# Altium project AS800-TempCB.PrjPcb
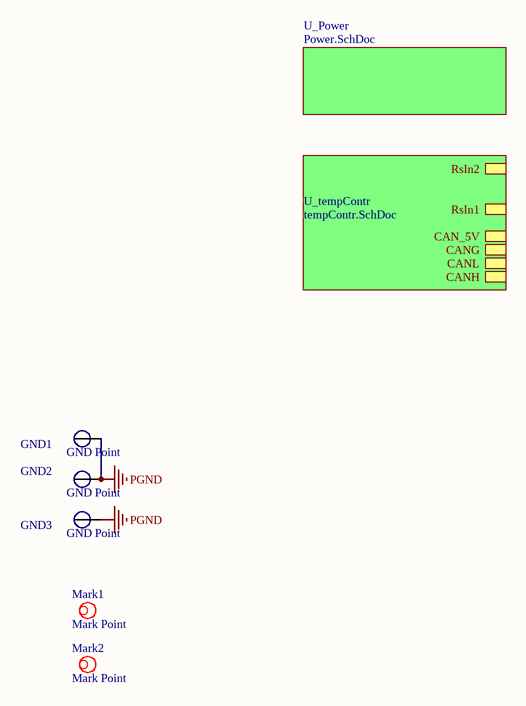
[diagram p0: MB_TOP.SchDoc]
3 sheets, 246 parts. Net scope: hierarchical (ports join the sheet entries above them; power ports are global).
Board file: AS800-Temp V1.1.PcbDoc
Sheets:
  MB_TOP.SchDoc
    U_Power = Power.SchDoc
    U_tempContr = tempContr.SchDoc

## Sheet MB_TOP.SchDoc
size A4; PageSetup: Record=PageOptions|CenterHorizontal=True|CenterVertical=True|PrintScale=0.36|XCorrection=1.00|YCorrection=1.00|PrintKind=0|BorderSize=5000000|LeftOffset=0|BottomOffset=0|Orientation=2|PaperLength=1000|PaperWidth=1000|Scale=100|PaperSource=7|PrintQuality=-4|MediaType=1|DitherType=10|PaperKind=A4|PrintScaleMode=1

### Parts
GND1  GND Point  [Gnd_Point]
GND2  GND Point  [Gnd_Point]
GND3  GND Point  [Gnd_Point]
Mark1  Mark Point  [MARK 3mm]
Mark2  Mark Point  [MARK 3mm]

### Sub-sheets
U_Power = Power.SchDoc: no entries
U_tempContr = tempContr.SchDoc: CANH, CANL, CANG, CAN_5V, RsIn1, RsIn2

### Nets
PGND: GND1.1(GND) GND2.1(GND) GND3.1(GND)

### Library data of the parts
GND1-GND3 = GND_Point
Mark1 Mark2 = MARK

## Sheet Power.SchDoc
size C
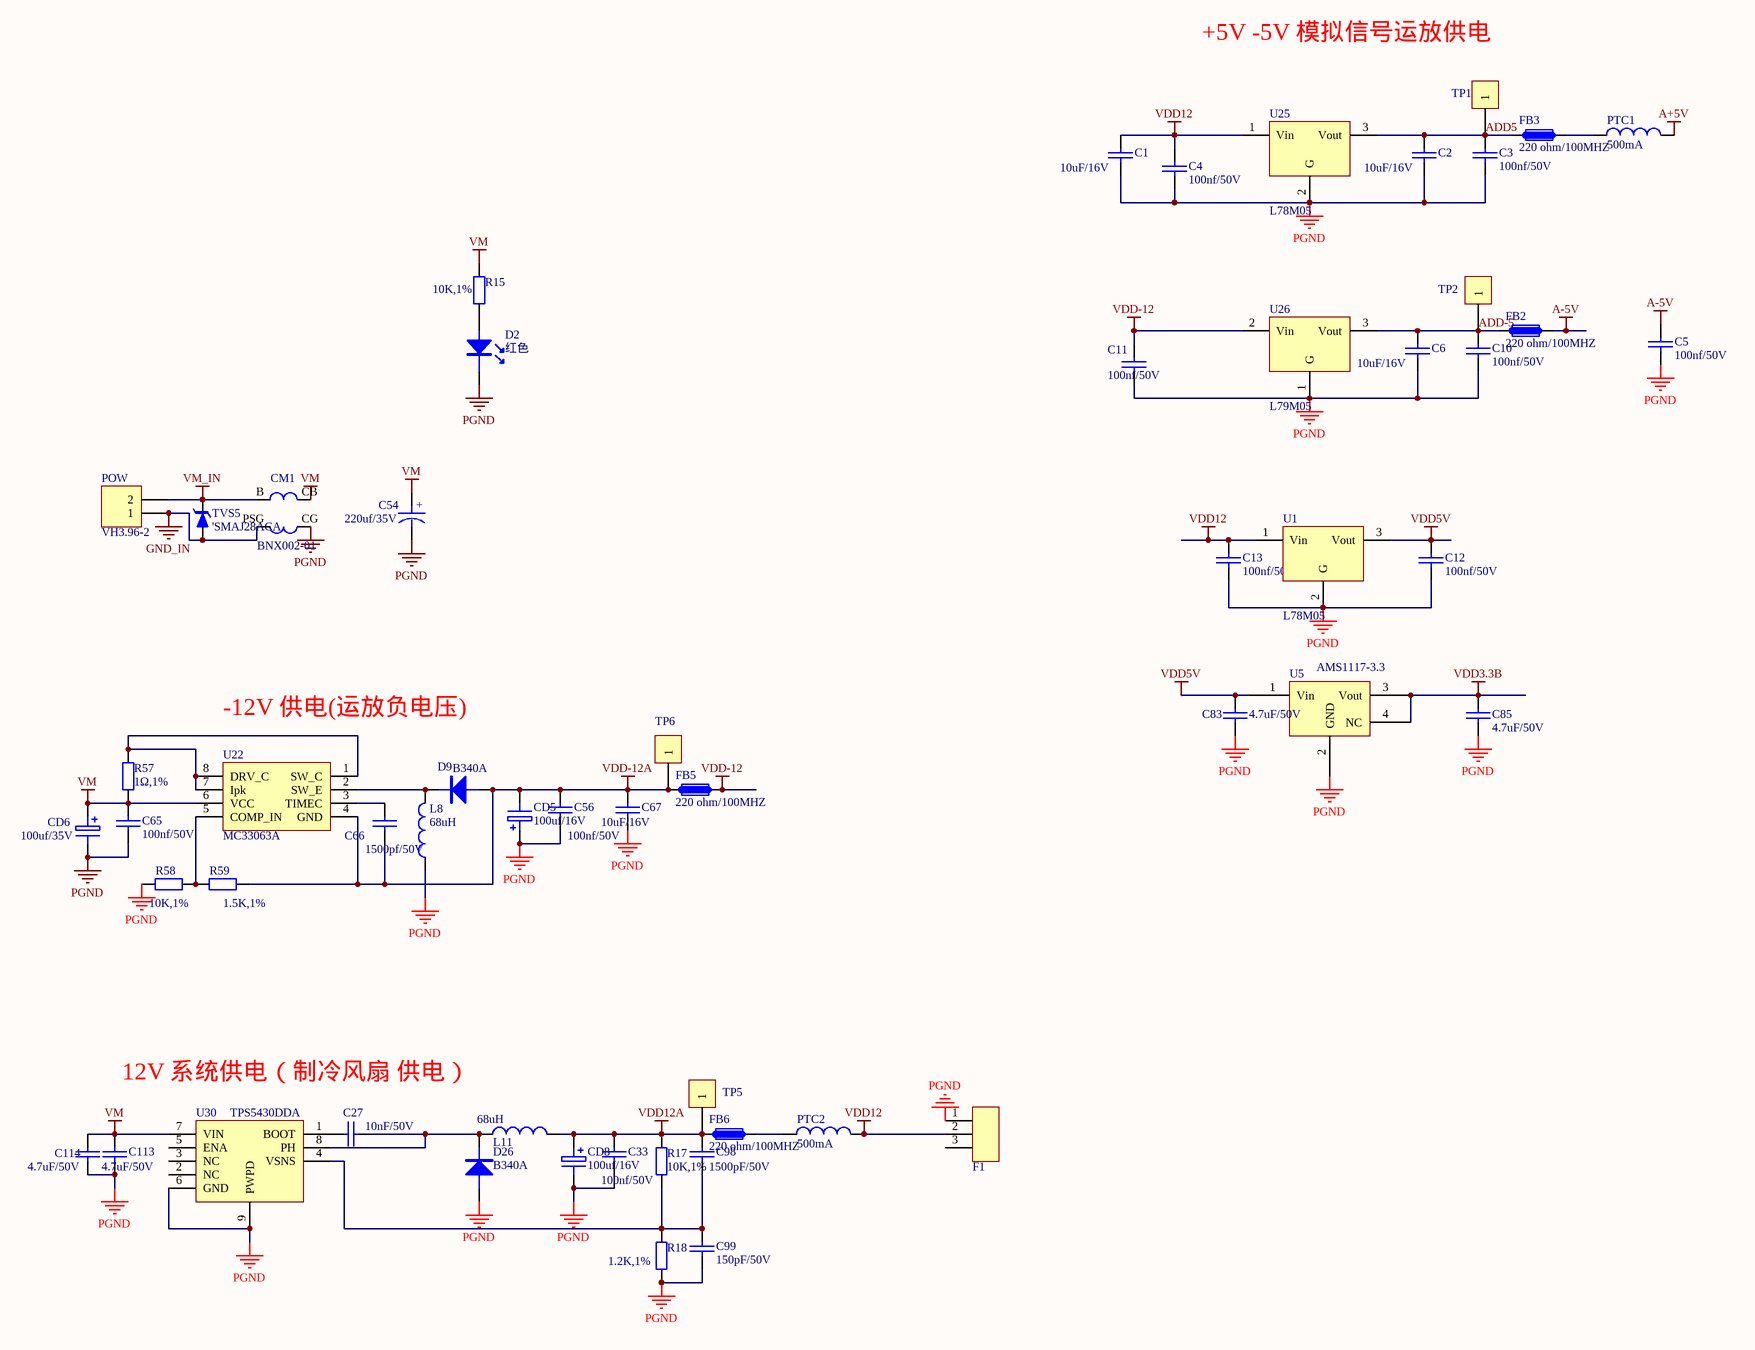
[diagram p1: Power.SchDoc]

### Parts
C1  10uF/16V  [1206]
C2  10uF/16V  [1206]
C3  100nf/50V  [0805]
C4  100nf/50V  [0805]
C5  100nf/50V  [0805]
C6  10uF/16V  [1206]
C10  100nf/50V  [0805]
C11  100nf/50V  [0805]
C12  100nf/50V  [0805]
C13  100nf/50V  [0805]
C27  10nF/50V  [0805]
C33  100nf/50V  [0805]
C54  220uf/35V  [CX8*10.5]
C56  100nf/50V  [0805]
C65  100nf/50V  [0805]
C66  1500pf/50V  [0805]
C67  10uF/16V  [1206]
C83  4.7uF/50V  [1206]
C85  4.7uF/50V  [1206]
C98  1500pF/50V  [0805]
C99  150pF/50V  [0805]
C113  4.7uF/50V  [1206]
C114  4.7uF/50V  [1206]
CD5  100uf/16V  [7343D]
CD6  100uf/35V  [CX6.3*5.4]
CD8  100uf/16V  [7343D]
CM1  BNX002-01  [BNX-002-01]
D2  value 红色  [LED_0805]  (hidden comment: LED,Red)
D9  B340A  [SMA]
D26  B340A  [SMA]
F1  KF2510-3P  [KF2510-3]  (value not drawn)
FB2  220 ohm/100MHZ  [0805]
FB3  220 ohm/100MHZ  [0805]
FB5  220 ohm/100MHZ  [0805]
FB6  220 ohm/100MHZ  [0805]
L8  68uH  [INDUCTOR 6*6]
L11  68uH  [INDUCTOR 6*6]
POW  VH3.96-2  [VH3.96-2]
PTC1  value 500mA  [1210]  (hidden comment: PTCC)
PTC2  value 500mA  [1210]  (hidden comment: PTCC)
R15  10K,1%  [0805]
R17  10K,1%  [0805]
R18  1.2K,1%  [0805]
R57  1Ω,1%  [2512]
R58  10K,1%  [0805]
R59  1.5K,1%  [0805]
TP1  TP  [TP1]  (value not drawn)
TP2  TP  [TP1]  (value not drawn)
TP5  TP  [TP1]  (value not drawn)
TP6  TP  [TP1]  (value not drawn)
TVS5  'SMAJ28ACA  [SMB]
U1  L78M05  [TO-252]
U5  AMS1117-3.3  [SOT223S]
U22  MC33063A  [SOIC8]
U25  L78M05  [TO-252]
U26  L79M05  [TO-252]
U30  TPS5430DDA  [S0IC8-DDA]

### Nets
A+5V: PTC1.2
A-5V: C5.1 FB2.2
GND_IN: CM1.PSG POW.1 TVS5.A
PGND: C1.2 C2.2 C3.2 C4.2 C5.2 C6.2 C10.2 C11.2 C12.2 C13.2 C33.2 C54.2 C56.2 C65.2 C67.2 C83.2 C85.2 C99.1 C113.2 C114.2 CD5.1 CD6.2 CD8.2 CM1.CG D2.K D26.A F1.1 L8.1 R18.1 R58.2 U1.2(G) U5.2(GND) U25.2(G) U26.1(G) U30.6(GND) U30.9(PWPD)
VDD3.3B: C85.1 U5.3(Vout) U5.4(NC)
VDD5V: C12.1 C83.1 U1.3(Vout) U5.1(Vin)
VDD12: C1.1 C4.1 C13.1 F1.2 PTC2.2 U1.1(Vin) U25.1(Vin)
VDD12A: C33.1 C98.2 CD8.1 FB6.1 L11.2 R17.2 TP5.1
VDD-12: C11.1 FB5.2 U26.2(Vin)
VDD-12A: C56.1 C66.2 C67.1 CD5.2 D9.A FB5.1 R59.1 TP6.1 U22.4(GND)
VM: C54.1 C65.1 C113.1 C114.1 CD6.1 CM1.CB R15.1 R57.2 U22.6(VCC) U30.7(VIN)
VM_IN: CM1.B POW.2 TVS5.K
ADD5: C2.1 C3.1 FB3.1 TP1.1 U25.3(Vout)
ADD-5: C6.1 C10.1 FB2.1 TP2.1 U26.3(Vout)
NetC27_1: C27.1 U30.1(BOOT)
NetC27_2: C27.2 D26.K L11.1 U30.8(PH)
NetC66_1: C66.1 U22.3(TIMEC)
NetC98_1: C98.1 C99.2 R17.1 R18.2 U30.4(VSNS)
NetD2_A: D2.A R15.2
NetD9_K: D9.K L8.2 U22.2(SW_E)
NetFB3_2: FB3.2 PTC1.1
NetFB6_2: FB6.2 PTC2.1
NetR57_1: R57.1 U22.1(SW_C) U22.7(Ipk) U22.8(DRV_C)
NetR58_1: R58.1 R59.2 U22.5(COMP_IN)

Not connected (* = marked no-connect by the designer): F1 3; U30 2(NC) 3(NC) 5(ENA)

### Notes on the sheet
- +5V -5V 模拟信号运放供电
- -12V 供电(运放负电压)
- 12V 系统供电（制冷风扇 供电）
- (in symbol CAPACITOR POL) +

### Library data of the parts
C1-C6 C10-C13 C27 C33 C56 C65-C67 C83 C85 C98 C99 C113 C114 = CAP: Capacitor
  C1 C2 C6: Value: 10uF/16V
  C27: Value: 10nF/50V
  C33 C56 C65: Value: 100nf/50V
  C66: Value: 1500pf/50V
  C83 C85 C113 C114: Value: 4.7uF/50V
  C98: Value: 1500pF/50V
  C99: Value: 150pF/50V
C54 = CAPACITOR POL: Capacitor
CD5 CD6 CD8 = Capacitor Electrolytic: Electrolytic Capacitor
CM1 = EMIFIL-BNX: inductor
D2 = LED
D9 D26 = DIODE
F1 = KF2510-3P: KF2510-2.54-3P 针座
FB2 FB3 FB5 FB6 = Ferrite Bead
L8 L11 = INDUCTOR
POW = VH-2: VH3.96 2P 插座; Revision: 17-Jul-2002: Re-released for DXP Platform.; Publisher: Altium Limited
R15 R17 R18 R57-R59 = Res2: Resistor; Published: 8-Jun-2000; Revision: July-2002: Re-released for DXP Platform.; Publisher: Altium Limited
TP1 TP2 TP5 TP6 = TP: Connector
TVS5 = TVS
U1 U25 = L78XX: L78XX系列芯片
U5 = LM1117-33
U26 = L79XX: L79XX系列芯片

## Sheet tempContr.SchDoc
size D; Author: 七星; Engineer: 七星; Revision: V1.0
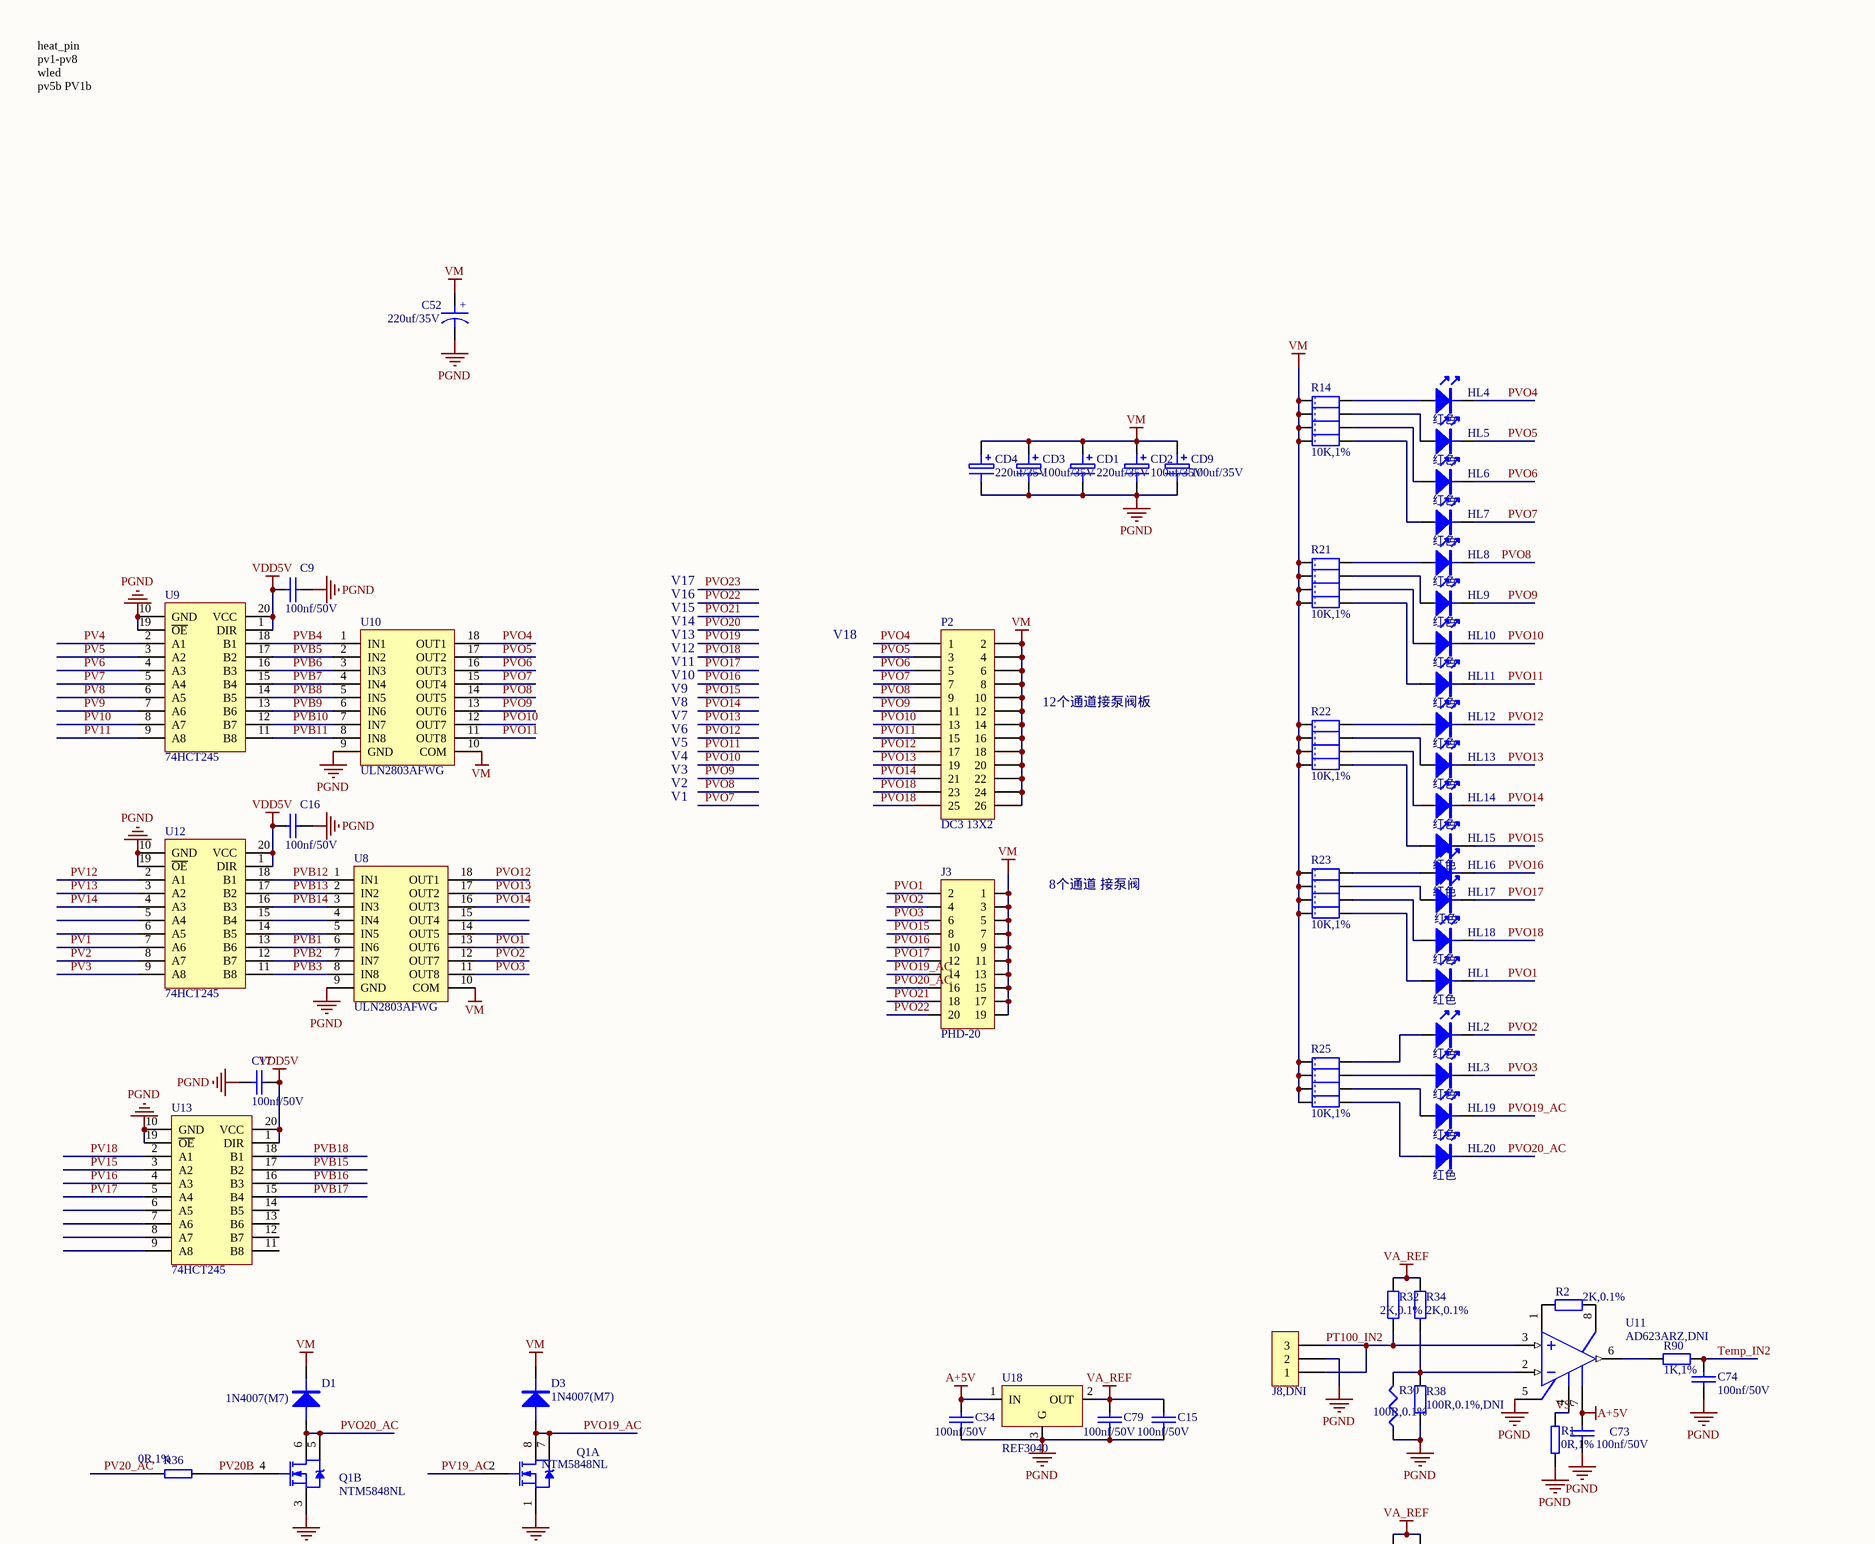
[diagram p2: tempContr.SchDoc, top left]
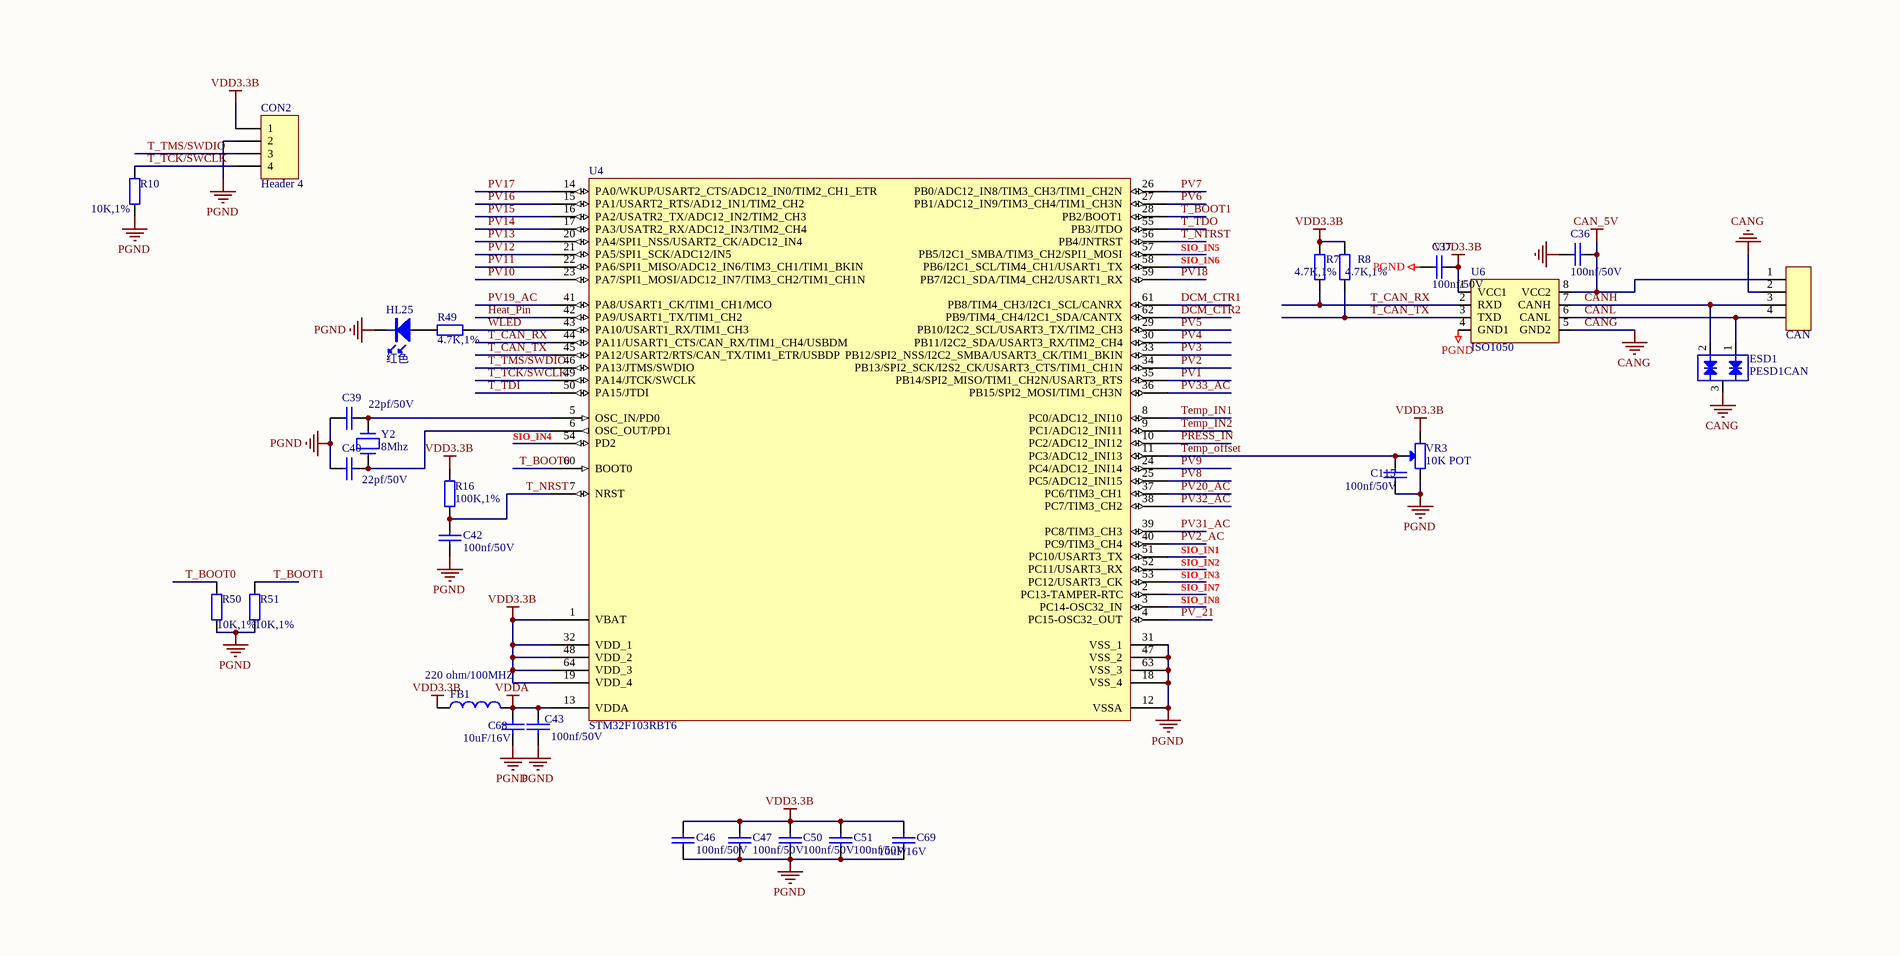
[diagram p3: tempContr.SchDoc, top right]
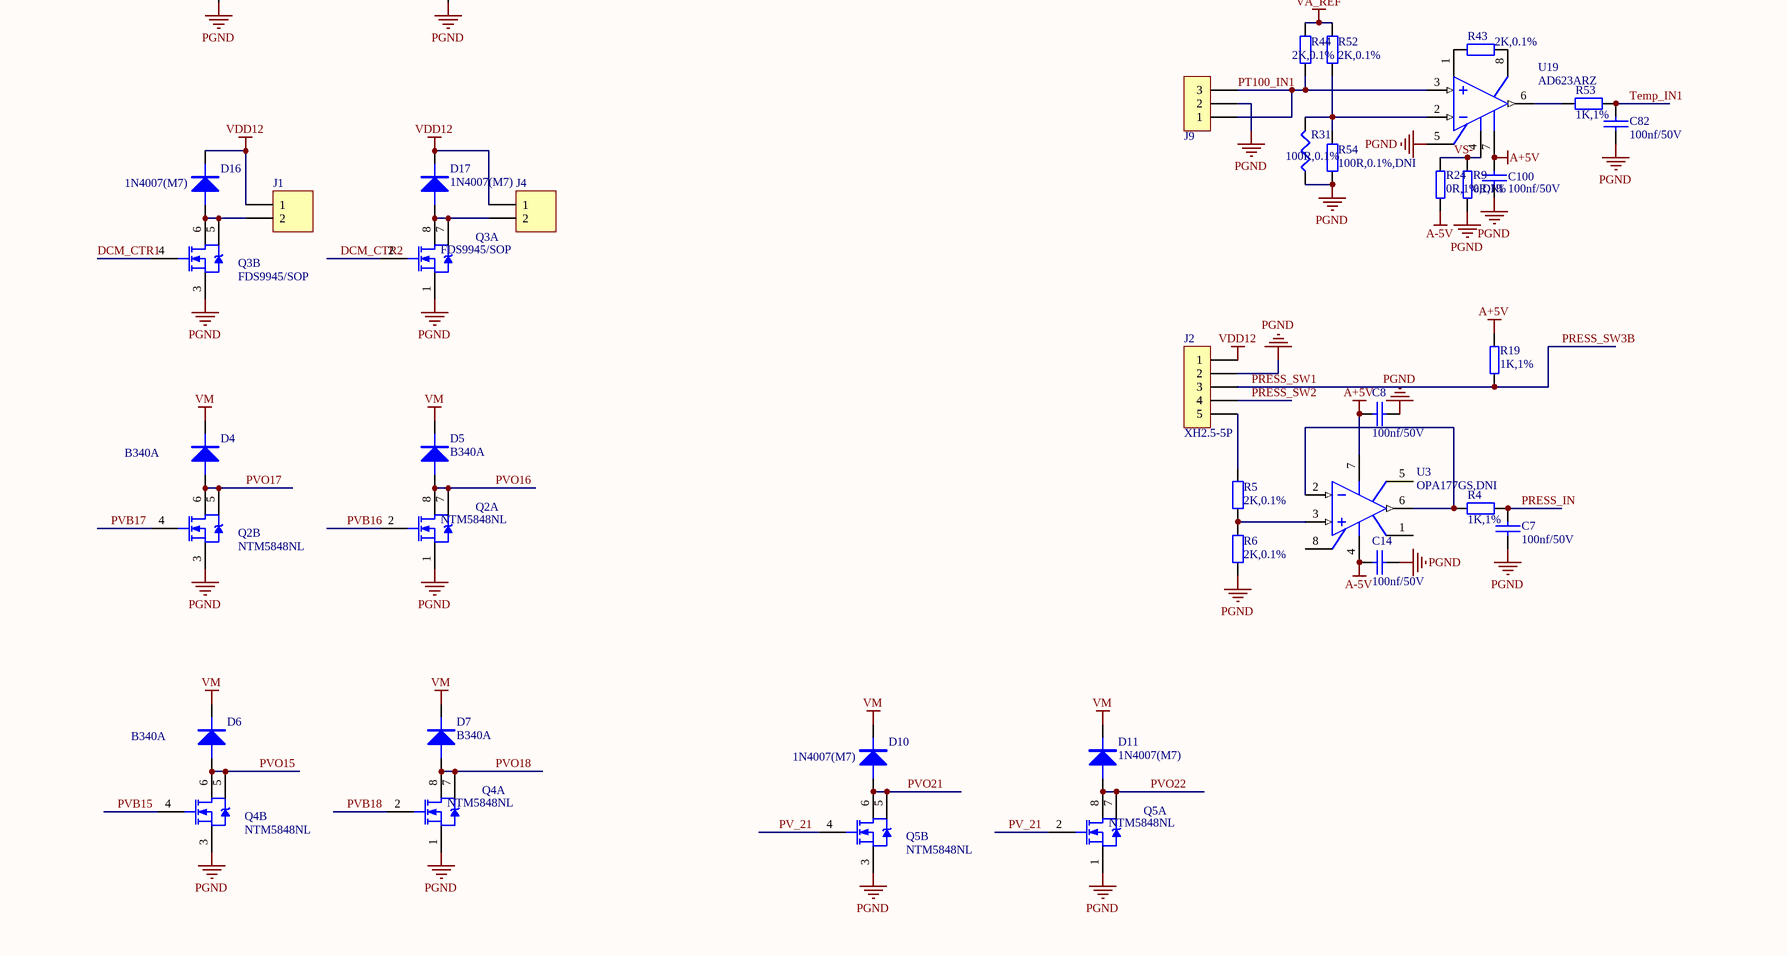
[diagram p4: tempContr.SchDoc, bottom left]
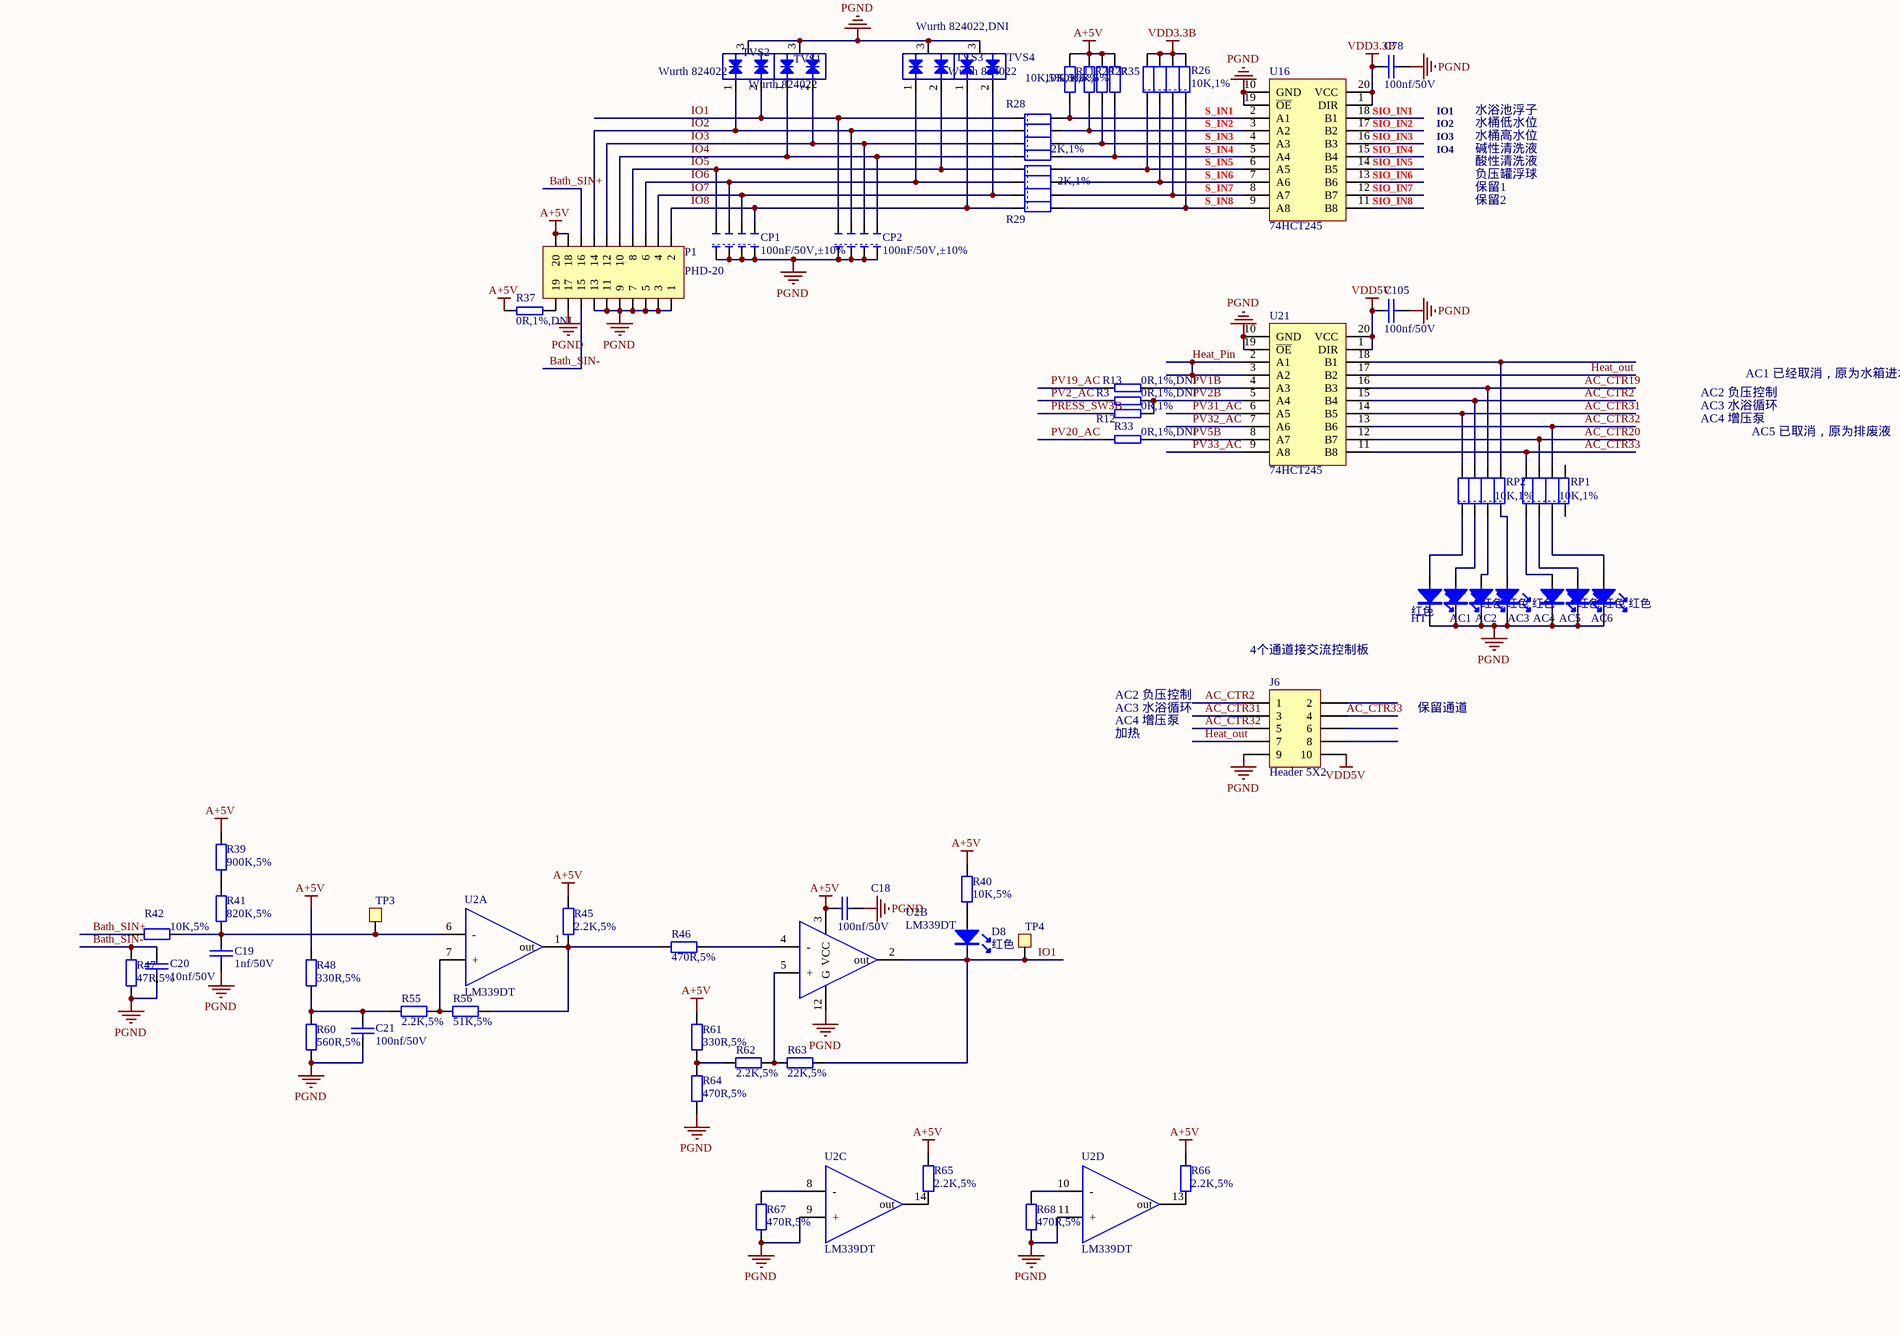
[diagram p5: tempContr.SchDoc, bottom right]

### Parts
AC1  value 红色  [LED_0805]  (hidden comment: LED,Red)
AC2  value 红色  [LED_0805]  (hidden comment: LED,Red)
AC3  value 红色  [LED_0805]  (hidden comment: LED,Red)
AC4  value 红色  [LED_0805]  (hidden comment: LED,Red)
AC5  value 红色  [LED_0805]  (hidden comment: LED,Red)
AC6  value 红色  [LED_0805]  (hidden comment: LED,Red)
C7  100nf/50V  [0805]
C8  100nf/50V  [0805]
C9  100nf/50V  [0805]
C14  100nf/50V  [0805]
C15  100nf/50V  [0805]
C16  100nf/50V  [0805]
C17  100nf/50V  [0805]
C18  100nf/50V  [0805]
C19  1nf/50V  [0805]
C20  10nf/50V  [0805]
C21  100nf/50V  [0805]
C34  100nf/50V  [0805]
C36  100nf/50V  [0805]
C37  100nf/50V  [0805]
C39  22pf/50V  [0805]
C40  22pf/50V  [0805]
C42  100nf/50V  [0805]
C43  100nf/50V  [0805]
C46  100nf/50V  [0805]
C47  100nf/50V  [0805]
C50  100nf/50V  [0805]
C51  100nf/50V  [0805]
C52  220uf/35V  [CX8*10.5]
C68  10uF/16V  [1206]
C69  10uF/16V  [1206]
C73  100nf/50V  [0805]
C74  100nf/50V  [0805]
C78  100nf/50V  [0805]
C79  100nf/50V  [0805]
C82  100nf/50V  [0805]
C100  100nf/50V  [0805]
C105  100nf/50V  [0805]
C115  100nf/50V  [0805]
CAN  XH2.54-4P  [XH2.5-4P]  (value not drawn)
CD1  220uf/35V  [CX8*10.5]
CD2  100uf/35V  [CX6.3*5.4]
CD3  100uf/35V  [CX6.3*5.4]
CD4  220uf/35V  [CX8*10.5]
CD9  100uf/35V  [CX6.3*5.4]
CON2  Header 4  [HDR1X4]
CP1  100nF/50V,±10%  [8P4R_0603]
CP2  100nF/50V,±10%  [8P4R_0603]
D1  1N4007(M7)  [SMA(AK)]
D3  1N4007(M7)  [SMA(AK)]
D4  B340A  [SMA(AK)]
D5  B340A  [SMA(AK)]
D6  B340A  [SMA(AK)]
D7  B340A  [SMA(AK)]
D8  value 红色  [LED_0805]  (hidden comment: LED)
D10  1N4007(M7)  [SMA(AK)]
D11  1N4007(M7)  [SMA(AK)]
D16  1N4007(M7)  [SMA(AK)]
D17  1N4007(M7)  [SMA(AK)]
ESD1  PESD1CAN  [SOT233]
FB1  220 ohm/100MHZ  [0805]
HL1  value 红色  [LED_0805]  (hidden comment: LED,Red)
HL2  value 红色  [LED_0805]  (hidden comment: LED,Red)
HL3  value 红色  [LED_0805]  (hidden comment: LED,Red)
HL4  value 红色  [LED_0805]  (hidden comment: LED,Red)
HL5  value 红色  [LED_0805]  (hidden comment: LED,Red)
HL6  value 红色  [LED_0805]  (hidden comment: LED,Red)
HL7  value 红色  [LED_0805]  (hidden comment: LED,Red)
HL8  value 红色  [LED_0805]  (hidden comment: LED,Red)
HL9  value 红色  [LED_0805]  (hidden comment: LED,Red)
HL10  value 红色  [LED_0805]  (hidden comment: LED,Red)
HL11  value 红色  [LED_0805]  (hidden comment: LED,Red)
HL12  value 红色  [LED_0805]  (hidden comment: LED,Red)
HL13  value 红色  [LED_0805]  (hidden comment: LED,Red)
HL14  value 红色  [LED_0805]  (hidden comment: LED,Red)
HL15  value 红色  [LED_0805]  (hidden comment: LED,Red)
HL16  value 红色  [LED_0805]  (hidden comment: LED,Red)
HL17  value 红色  [LED_0805]  (hidden comment: LED,Red)
HL18  value 红色  [LED_0805]  (hidden comment: LED,Red)
HL19  value 红色  [LED_0805]  (hidden comment: LED,Red)
HL20  value 红色  [LED_0805]  (hidden comment: LED,Red)
HL25  value 红色  [LED_0805]  (hidden comment: LED,Red)
HT  value 红色  [LED_0805]  (hidden comment: LED,Red)
J1  XH2.54-2P  [XH2.5-2P]  (value not drawn)
J2  XH2.5-5P  [XH2.5-5P]
J3  PHD-20  [PHD-20]
J4  XH2.54-2P  [XH2.5-2P]  (value not drawn)
J6  Header 5X2  [DC3-10]
J8,DNI  XH2.54-3P  [XH2.5-3P]  (value not drawn)
J9  XH2.54-3P  [XH2.5-3P]  (value not drawn)
P1  PHD-20  [PHD-20]
P2  DC3 13X2  [DC3-2X13]
Q1  NTM5848NL  [SOIC8]  (parts A,B of 2)
Q2  NTM5848NL  [SOIC8]  (parts A,B of 2)
Q3  FDS9945/SOP  [SOIC8]  (parts A,B of 2)
Q4  NTM5848NL  [SOIC8]  (parts A,B of 2)
Q5  NTM5848NL  [SOIC8]  (parts A,B of 2)
R1  0R,1%  [0805]
R2  2K,0.1%  [0805]
R3  0R,1%,DNI  [0805]
R4  1K,1%  [0805]
R5  2K,0.1%  [0805]
R6  2K,0.1%  [0805]
R7  4.7K,1%  [0805]
R8  4.7K,1%  [0805]
R9  0R,1%  [0805]
R10  10K,1%  [0805]
R11  10K,5%  [0805]
R12  0R,1%  [0805]
R13  0R,1%,DNI  [0805]
R14  10K,1%  [8P4R_0603]
R16  100K,1%  [0805]
R19  1K,1%  [0805]
R20  10K,5%  [0805]
R21  10K,1%  [8P4R_0603]
R22  10K,1%  [8P4R_0603]
R23  10K,1%  [8P4R_0603]
R24  0R,1%,DNI  [0805]
R25  10K,1%  [8P4R_0603]
R26  10K,1%  [8P4R_0603]
R27  10K,5%  [0805]
R28  2K,1%  [8P4R_0603]
R29  2K,1%  [8P4R_0603]
R30  100R,0.1%  [AXIAL-0.4]
R31  100R,0.1%  [AXIAL-0.4]
R32  2K,0.1%  [0805]
R33  0R,1%,DNI  [0805]
R34  2K,0.1%  [0805]
R35  10K,5%  [0805]
R36  0R,1%  [0805]
R37  0R,1%,DNI  [0805]
R38  100R,0.1%,DNI  [0805]
R39  900K,5%  [0805]
R40  10K,5%  [0805]
R41  820K,5%  [0805]
R42  10K,5%  [0805]
R43  2K,0.1%  [0805]
R44  2K,0.1%  [0805]
R45  2.2K,5%  [0805]
R46  470R,5%  [0805]
R47  47R,5%  [0805]
R48  330R,5%  [0805]
R49  4.7K,1%  [0805]
R50  10K,1%  [0805]
R51  10K,1%  [0805]
R52  2K,0.1%  [0805]
R53  1K,1%  [0805]
R54  100R,0.1%,DNI  [0805]
R55  2.2K,5%  [0805]
R56  51K,5%  [0805]
R60  560R,5%  [0805]
R61  330R,5%  [0805]
R62  2.2K,5%  [0805]
R63  22K,5%  [0805]
R64  470R,5%  [0805]
R65  2.2K,5%  [0805]
R66  2.2K,5%  [0805]
R67  470R,5%  [0805]
R68  470R,5%  [0805]
R90  1K,1%  [0805]
RP1  10K,1%  [8P4R_0603]
RP2  10K,1%  [8P4R_0603]
TP3  TP  [TP1]  (value not drawn)
TP4  TP  [TP1]  (value not drawn)
TVS1  Wurth 824022  [SOT233]
TVS2  Wurth 824022  [SOT233]
TVS3  Wurth 824022  [SOT233]
TVS4  Wurth 824022,DNI  [SOT233]
U2  LM339DT  [SOIC14]  (parts A,B,C,D of 4)
U3  OPA177GS,DNI  [SOIC8]
U4  STM32F103RBT6  [LQFP64]
U6  ISO1050  [SOP8-DUB]
U8  ULN2803AFWG  [SOIC18-DW]
U9  74HCT245  [TSSOP20]
U10  ULN2803AFWG  [SOIC18-DW]
U11  AD623ARZ,DNI  [SOIC8]
U12  74HCT245  [TSSOP20]
U13  74HCT245  [TSSOP20]
U16  74HCT245  [TSSOP20]
U18  REF3040  [SOT233]
U19  AD623ARZ  [SOIC8]
U21  74HCT245  [TSSOP20]
VR3  10K POT  [VR3296]
Y2  8Mhz  [HC-49S]

### Nets
A+5V: C8.1 C18.1 C34.2 C73.1 C100.1 P1.18 P1.20 R11.2 R19.1 R20.2 R27.2 R35.2 R37.2 R39.1 R40.2 R45.2 R48.1 R61.1 R65.2 R66.2 U2.3(VCC) U3.7(V+) U11.7(V+) U18.1(IN) U19.7(V+)
A-5V: C14.1 R24.1 U3.4(V-)
CAN_5V: C36.2 CAN.1 U6.8(VCC2)
CANG: C36.1 CAN.2 ESD1.3 U6.5(GND2)
PGND: AC1.K AC2.K AC3.K AC4.K AC5.K AC6.K C7.1 C8.2 C9.1 C14.2 C15.1 C16.1 C17.1 C18.2 C19.2 C20.2 C21.2 C34.1 C37.1 C39.1 C40.1 C42.2 C43.2 C46.2 C47.2 C50.2 C51.2 C52.2 C68.1 C69.2 C73.2 C74.1 C78.1 C79.1 C82.1 C100.2 C105.1 C115.2 CD1.2 CD2.2 CD3.2 CD4.2 CD9.2 CON2.2 CP1.1 CP1.3 CP1.5 CP1.7 CP2.1 CP2.3 CP2.5 CP2.7 HL25.K HT.K J2.2 J6.9 J8,DNI.2 J9.2 P1.1 P1.3 P1.5 P1.7 P1.9 P1.11 P1.13 P1.17 Q1.1(S) Q1.3(S) Q2.1(S) Q2.3(S) Q3.1(S) Q3.3(S) Q4.1(S) Q4.3(S) Q5.1(S) Q5.3(S) R1.1 R6.2 R9.1 R10.2 R30.1 R31.1 R38.2 R47.2 R50.2 R51.2 R54.2 R60.2 R64.2 R67.2 R68.2 TVS1.3 TVS2.3 TVS3.3 TVS4.3 U2.9(+) U2.11(+) U2.12(G) U4.12(VSSA) U4.18(VSS_4) U4.31(VSS_1) U4.47(VSS_2) U4.63(VSS_3) U6.4(GND1) U8.9(GND) U9.10(GND) U9.19(~{OE}) U10.9(GND) U11.5(REF) U12.10(GND) U12.19(~{OE}) U13.10(GND) U13.19(~{OE}) U16.10(GND) U16.19(~{OE}) U18.3(G) U19.5(REF) U21.10(GND) U21.19(~{OE}) VR3.1
VA_REF: C15.2 C79.2 R32.1 R34.1 R44.1 R52.1 U18.2(OUT)
VDD3.3B: C37.2 C46.1 C47.1 C50.1 C51.1 C69.1 C78.2 CON2.1 FB1.1 R7.2 R8.2 R16.2 R26.2 R26.4 R26.6 R26.8 U4.1(VBAT) U4.19(VDD_4) U4.32(VDD_1) U4.48(VDD_2) U4.64(VDD_3) U6.1(VCC1) U16.1(DIR) U16.20(VCC) VR3.2
VDD5V: C9.2 C16.2 C17.2 C105.2 J6.10 U9.1(DIR) U9.20(VCC) U12.1(DIR) U12.20(VCC) U13.1(DIR) U13.20(VCC) U21.1(DIR) U21.20(VCC)
VDD12: D16.K D17.K J1.1 J2.1 J4.1
VDDA: C43.1 C68.2 FB1.2 U4.13(VDDA)
VM: C52.1 CD1.1 CD2.1 CD3.1 CD4.1 CD9.1 D1.K D3.K D4.K D5.K D6.K D7.K D10.K D11.K J3.1 J3.3 J3.5 J3.7 J3.9 J3.11 J3.13 J3.15 J3.17 J3.19 P2.2 P2.4 P2.6 P2.8 P2.10 P2.12 P2.14 P2.16 P2.18 P2.20 P2.22 P2.24 P2.26 R14.1 R14.3 R14.5 R14.7 R21.1 R21.3 R21.5 R21.7 R22.1 R22.3 R22.5 R22.7 R23.1 R23.3 R23.5 R23.7 R25.1 R25.3 R25.5 R25.7 U8.10(COM) U10.10(COM)
AC_CTR2: J6.1 RP2.4 U21.15(B4)
AC_CTR19: RP2.6 U21.16(B3)
AC_CTR20: RP1.4 U21.12(B7)
AC_CTR31: J6.3 RP2.2 U21.14(B5)
AC_CTR32: J6.5 RP1.6 U21.13(B6)
AC_CTR33: J6.4 RP1.2 U21.11(B8)
Bath_SIN+: P1.16 R42.2
Bath_SIN-: C20.1 P1.15 R47.1
CANH: CAN.3 ESD1.2 U6.7(CANH)
CANL: CAN.4 ESD1.1 U6.6(CANL)
DCM_CTR1: Q3.4(G) U4.61(PB8/TIM4_CH3/I2C1_SCL/CANRX)
DCM_CTR2: Q3.2(G) U4.62(PB9/TIM4_CH4/I2C1_SDA/CANTX)
Heat_out: J6.7 U21.17(B2)
Heat_Pin: U4.42(PA9/USART1_TX/TIM1_CH2) U21.2(A1) U21.3(A2)
IO1: CP2.2 D8.K R28.1 R63.2 TP4.1 TVS2.2 U2.2(out)
IO2: CP2.4 P1.14 R28.3 TVS2.1
IO3: CP2.6 P1.12 R28.5 TVS1.2
IO4: CP2.8 P1.10 R28.7 TVS1.1
IO5: CP1.2 P1.8 R29.1 TVS3.2
IO6: CP1.4 P1.6 R29.3 TVS3.1
IO7: CP1.6 P1.4 R29.5 TVS4.2
IO8: CP1.8 P1.2 R29.7 TVS4.1
PRESS_IN: C7.2 R4.1 U4.10(PC2/ADC12_INI12)
PRESS_SW1: J2.3 R12.1 R19.2  [also labelled PRESS_SW3B]
PRESS_SW2: J2.4
PT100_IN1: J9.1 J9.3 R44.2 U19.3(IN+)
PT100_IN2: J8,DNI.1 J8,DNI.3 R32.2 U11.3(IN+)
PV1: U4.35(PB14/SPI2_MISO/TIM1_CH2N/USART3_RTS) U12.7(A6)
PV1B: R13.2 U21.4(A3)
PV2: U4.34(PB13/SPI2_SCK/I2S2_CK/USART3_CTS/TIM1_CH1N) U12.8(A7)
PV2_AC: R3.1 U4.40(PC9/TIM3_CH4)
PV2B: R3.2 R12.2 U21.5(A4)
PV3: U4.33(PB12/SPI2_NSS/I2C2_SMBA/USART3_CK/TIM1_BKIN) U12.9(A8)
PV4: U4.30(PB11/I2C2_SDA/USART3_RX/TIM2_CH4) U9.2(A1)
PV5: U4.29(PB10/I2C2_SCL/USART3_TX/TIM2_CH3) U9.3(A2)
PV5B: R33.2 U21.8(A7)
PV6: U4.27(PB1/ADC12_IN9/TIM3_CH4/TIM1_CH3N) U9.4(A3)
PV7: U4.26(PB0/ADC12_IN8/TIM3_CH3/TIM1_CH2N) U9.5(A4)
PV8: U4.25(PC5/ADC12_INI15) U9.6(A5)
PV9: U4.24(PC4/ADC12_INI14) U9.7(A6)
PV10: U4.23(PA7/SPI1_MOSI/ADC12_IN7/TIM3_CH2/TIM1_CH1N) U9.8(A7)
PV11: U4.22(PA6/SPI1_MISO/ADC12_IN6/TIM3_CH1/TIM1_BKIN) U9.9(A8)
PV12: U4.21(PA5/SPI1_SCK/ADC12/IN5) U12.2(A1)
PV13: U4.20(PA4/SPI1_NSS/USART2_CK/ADC12_IN4) U12.3(A2)
PV14: U4.17(PA3/USATR2_RX/ADC12_IN3/TIM2_CH4) U12.4(A3)
PV15: U4.16(PA2/USATR2_TX/ADC12_IN2/TIM2_CH3) U13.3(A2)
PV16: U4.15(PA1/USART2_RTS/AD12_IN1/TIM2_CH2) U13.4(A3)
PV17: U4.14(PA0/WKUP/USART2_CTS/ADC12_IN0/TIM2_CH1_ETR) U13.5(A4)
PV18: U4.59(PB7/I2C1_SDA/TIM4_CH2/USART1_RX) U13.2(A1)
PV19_AC: Q1.2(G) R13.1 U4.41(PA8/USART1_CK/TIM1_CH1/MCO)
PV20_AC: R33.1 R36.1 U4.37(PC6/TIM3_CH1)
PV20B: Q1.4(G) R36.2
PV31_AC: U4.39(PC8/TIM3_CH3) U21.6(A5)
PV32_AC: U4.38(PC7/TIM3_CH2) U21.7(A6)
PV33_AC: U4.36(PB15/SPI2_MOSI/TIM1_CH3N) U21.9(A8)
PV_21: Q5.2(G) Q5.4(G) U4.4(PC15-OSC32_OUT)
PVB1: U8.6(IN6) U12.13(B6)
PVB2: U8.7(IN7) U12.12(B7)
PVB3: U8.8(IN8) U12.11(B8)
PVB4: U9.18(B1) U10.1(IN1)
PVB5: U9.17(B2) U10.2(IN2)
PVB6: U9.16(B3) U10.3(IN3)
PVB7: U9.15(B4) U10.4(IN4)
PVB8: U9.14(B5) U10.5(IN5)
PVB9: U9.13(B6) U10.6(IN6)
PVB10: U9.12(B7) U10.7(IN7)
PVB11: U9.11(B8) U10.8(IN8)
PVB12: U8.1(IN1) U12.18(B1)
PVB13: U8.2(IN2) U12.17(B2)
PVB14: U8.3(IN3) U12.16(B3)
PVB15: Q4.4(G) U13.17(B2)
PVB16: Q2.2(G) U13.16(B3)
PVB17: Q2.4(G) U13.15(B4)
PVB18: Q4.2(G) U13.18(B1)
PVO1: HL1.K J3.2 U8.13(OUT6)
PVO2: HL2.K J3.4 U8.12(OUT7)
PVO3: HL3.K J3.6 U8.11(OUT8)
PVO4: HL4.K P2.1 U10.18(OUT1)
PVO5: HL5.K P2.3 U10.17(OUT2)
PVO6: HL6.K P2.5 U10.16(OUT3)
PVO7: HL7.K P2.7 U10.15(OUT4)
PVO8: HL8.K P2.9 U10.14(OUT5)
PVO9: HL9.K P2.11 U10.13(OUT6)
PVO10: HL10.K P2.13 U10.12(OUT7)
PVO11: HL11.K P2.15 U10.11(OUT8)
PVO12: HL12.K P2.17 U8.18(OUT1)
PVO13: HL13.K P2.19 U8.17(OUT2)
PVO14: HL14.K P2.21 U8.16(OUT3)
PVO15: D6.A HL15.K J3.8 Q4.5(D) Q4.6(D)
PVO16: D5.A HL16.K J3.10 Q2.7(D) Q2.8(D)
PVO17: D4.A HL17.K J3.12 Q2.5(D) Q2.6(D)
PVO18: D7.A HL18.K P2.23 P2.25 Q4.7(D) Q4.8(D)
PVO19_AC: D3.A HL19.K J3.14 Q1.7(D) Q1.8(D)
PVO20_AC: D1.A HL20.K J3.16 Q1.5(D) Q1.6(D)
PVO21: D10.A J3.18 Q5.5(D) Q5.6(D)
PVO22: D11.A J3.20 Q5.7(D) Q5.8(D)
S_IN1: R11.1 R28.2 U16.2(A1)
S_IN2: R20.1 R28.4 U16.3(A2)
S_IN3: R27.1 R28.6 U16.4(A3)
S_IN4: R28.8 R35.1 U16.5(A4)
S_IN5: R26.1 R29.2 U16.6(A5)
S_IN6: R26.3 R29.4 U16.7(A6)
S_IN7: R26.5 R29.6 U16.8(A7)
S_IN8: R26.7 R29.8 U16.9(A8)
SIO_IN1: U4.51(PC10/USART3_TX) U16.18(B1)
SIO_IN2: U4.52(PC11/USART3_RX) U16.17(B2)
SIO_IN3: U4.53(PC12/USART3_CK) U16.16(B3)
SIO_IN4: U4.54(PD2) U16.15(B4)
SIO_IN5: U4.57(PB5/I2C1_SMBA/TIM3_CH2/SPI1_MOSI) U16.14(B5)
SIO_IN6: U4.58(PB6/I2C1_SCL/TIM4_CH1/USART1_TX) U16.13(B6)
SIO_IN7: U4.2(PC13-TAMPER-RTC) U16.12(B7)
SIO_IN8: U4.3(PC14-OSC32_IN) U16.11(B8)
T_BOOT0: R50.1 U4.60(BOOT0)
T_BOOT1: R51.1 U4.28(PB2/BOOT1)
T_CAN_RX: R7.1 U4.44(PA11/USART1_CTS/CAN_RX/TIM1_CH4/USBDM) U6.2(RXD)
T_CAN_TX: R8.1 U4.45(PA12/USART2/RTS/CAN_TX/TIM1_ETR/USBDP) U6.3(TXD)
T_NRST: C42.1 R16.1 U4.7(NRST)
T_NTRST: U4.56(PB4/JNTRST)
T_TCK/SWCLK: CON2.4 R10.1 U4.49(PA14/JTCK/SWCLK)
T_TDI: U4.50(PA15/JTDI)
T_TDO: U4.55(PB3/JTDO)
T_TMS/SWDIO: CON2.3 U4.46(PA13/JTMS/SWDIO)
Temp_IN1: C82.2 R53.1 U4.8(PC0/ADC12_INI10)
Temp_IN2: C74.2 R90.1 U4.9(PC1/ADC12_INI11)
Temp_offset: C115.1 U4.11(PC3/ADC12_INI13) VR3.3(W)
VS-: R1.2 R9.2 R24.2 U11.4(V-) U19.4(V-)
WLED: R49.2 U4.43(PA10/USART1_RX/TIM1_CH3)
NetAC1_A: AC1.A RP2.3
NetAC2_A: AC2.A RP2.5
NetAC3_A: AC3.A RP2.7
NetAC4_A: AC4.A RP1.1
NetAC5_A: AC5.A RP1.3
NetAC6_A: AC6.A RP1.5
NetC19_1: C19.1 R41.2 R42.1 TP3.1 U2.6(-)
NetC21_1: C21.1 R48.2 R55.1 R60.1
NetC39_2: C39.2 U4.5(OSC_IN/PD0) Y2.2
NetC40_2: C40.2 U4.6(OSC_OUT/PD1) Y2.1
NetD8_A: D8.A R40.1
NetD16_A: D16.A J1.2 Q3.5(D) Q3.6(D)
NetD17_A: D17.A J4.2 Q3.7(D) Q3.8(D)
NetHL1_A: HL1.A R23.8
NetHL2_A: HL2.A R25.2
NetHL3_A: HL3.A R25.4
NetHL4_A: HL4.A R14.2
NetHL5_A: HL5.A R14.4
NetHL6_A: HL6.A R14.6
NetHL7_A: HL7.A R14.8
NetHL8_A: HL8.A R21.2
NetHL9_A: HL9.A R21.4
NetHL10_A: HL10.A R21.6
NetHL11_A: HL11.A R21.8
NetHL12_A: HL12.A R22.2
NetHL13_A: HL13.A R22.4
NetHL14_A: HL14.A R22.6
NetHL15_A: HL15.A R22.8
NetHL16_A: HL16.A R23.2
NetHL17_A: HL17.A R23.4
NetHL18_A: HL18.A R23.6
NetHL19_A: HL19.A R25.6
NetHL20_A: HL20.A R25.8
NetHL25_A: HL25.A R49.1
NetHT_A: HT.A RP2.1
NetJ2_5: J2.5 R5.1
NetP1_19: P1.19 R37.1
NetR2_1: R2.1 U11.8(TAB)
NetR2_2: R2.2 U11.1(OS_NUL)
NetR4_2: R4.2 U3.2(IN-) U3.6(OUT)
NetR5_2: R5.2 R6.1 U3.3(IN+)
NetR30_2: R30.2 R34.2 R38.1 U11.2(IN-)
NetR31_2: R31.2 R52.2 R54.1 U19.2(IN-)
NetR39_2: R39.2 R41.1
NetR43_1: R43.1 U19.8(TAB)
NetR43_2: R43.2 U19.1(OS_NUL)
NetR45_1: R45.1 R46.1 R56.2 U2.1(out)
NetR46_2: R46.2 U2.4(-)
NetR53_2: R53.2 U19.6(OUT)
NetR55_2: R55.2 R56.1 U2.7(+)
NetR61_2: R61.2 R62.1 R64.1
NetR62_2: R62.2 R63.1 U2.5(+)
NetR65_1: R65.1 U2.14(out)
NetR66_1: R66.1 U2.13(out)
NetR67_1: R67.1 U2.8(-)
NetR68_1: R68.1 U2.10(-)
NetR90_2: R90.2 U11.6(OUT)
NetRP2_8: RP2.8 U21.18(B1)
NetU8_4: U8.4(IN4) U12.15(B4)
NetU8_5: U8.5(IN5) U12.14(B5)

Not connected (* = marked no-connect by the designer): J6 2 6 8; RP1 7 8; U3 1(OS_NUL) 5(TAB) 8(OS_NUL); U8 14(OUT5) 15(OUT4); U12 5(A4) 6(A5); U13 6(A5) 7(A6) 8(A7) 9(A8) 11(B8) 12(B7) 13(B6) 14(B5)

### Notes on the sheet
- heat_pin
  pv1-pv8
  wled
  pv5b PV1b
- V16
- V17
- V11
- V12
- V13
- V14
- V15
- V18
- V6
- V7
- V8
- V9
- V10
- (near P2) 12个通道接泵阀板
- V1
- V2
- V3
- V4
- V5
- 8个通道 接泵阀
- IO1
- IO2
- IO3
- 水浴池浮子
- 水桶低水位
- 水桶高水位
- IO4
- 碱性清洗液
- 酸性清洗液
- 负压罐浮球
- 保留1
- 保留2
- AC2 负压控制
- AC1 已经取消，原为水箱进水控制
- AC3 水浴循环
- AC4 增压泵
- AC5 已取消，原为排废液
- (near J6) 4个通道接交流控制板
- 保留通道
- 加热
- (in symbol CAPACITOR POL) +

### Library data of the parts
AC1-AC6 HL1-HL20 HL25 HT = LED
C7-C9 C14-C21 C34 C36 C37 C39 C40 C42 C43 C46 C47 C50 C51 C68 C69 C73 C74 C78 C79 C82 C100 C105 C115 = CAP: Capacitor
  C7 C18 C21 C36 C37 C42 C43 C46 C47 C50 C51 C74 C82 C115: Value: 100nf/50V
  C19: Value: 1nf/50V
  C20: Value: 10nf/50V
  C39 C40: Value: 22pf/50V
C52 = CAPACITOR POL: Capacitor
CAN = XH2.54-4P: XH2.54-4P 针座
CD1-CD4 CD9 = Capacitor Electrolytic: Electrolytic Capacitor
CON2 = Header 4: Header, 4-Pin; LatestRevisionDate: 17-Jul-2002; LatestRevisionNote: Re-released for DXP Platform.; Publisher: Altium Limited
CP1 CP2 = CAP 1*4
D1 D3-D7 D10 D11 D16 D17 = DIODE
ESD1 TVS1-TVS4 = TVS-2: Diode
  ESD1: Value: PESD1CAN
  TVS1-TVS3: Value: Wurth 824022
  TVS4: Value: Wurth 824022,DNI
FB1 = INDUCTOR: Value: 150R
J1 J4 = XH2.54-2P: XH2.54-2P 针座; Revision: 17-Jul-2002: Re-released for DXP Platform.; Publisher: Altium Limited
J2 = XH2.54-5P: XH2.5-5P 针座
J3 P1 = PHD-20: PHD-20针座; Revision: 17-Jul-2002: Re-released for DXP Platform.; Publisher: Altium Limited
J6 = Header 5X2: Header, 5-Pin, Dual row; LatestRevisionDate: 17-Jul-2002; LatestRevisionNote: Re-released for DXP Platform.; Publisher: Altium Limited
J8,DNI J9 = XH2.54-3P: XH2.54-3P 针座
P2 = Header 13X2: Header, 13-Pin, Dual row; LatestRevisionDate: 17-Jul-2002; LatestRevisionNote: Re-released for DXP Platform.; Publisher: Altium Limited
Q1-Q5 = NMOS-9945: N-Channel Power MOSFET; Note: Pin 2 is electrically connected to pin 4.; Code - JEDEC: TO-220-AB; Published: 8-Jun-2000; Revision: July-2002: Re-released for DXP Platform.; Datasheet: Latest Revision: PD-9.814; Package Reference: TO-220AB; Publisher: Altium Limited
R1 R3 R9 R12 R13 R19 R24 R33 R36 R37 = Resistor: R
R2 R5 R6 R32 R34 R38 R43 R44 R52 R54 = Res Semi: Semiconductor Resistor; Published: 8-Jun-2000; Revision: July-2002: Re-released for DXP Platform.; Publisher: Altium Limited
R4 R7 R8 R10 R11 R16 R20 R27 R35 R39-R42 R45-R51 R53 R55 R56 R60-R68 R90 = Res2: Resistor; Published: 8-Jun-2000; Revision: July-2002: Re-released for DXP Platform.; Publisher: Altium Limited
  R10 R50 R51: Value: 10K,1%
  R16: Value: 100K,1%
R14 R21-R23 R25 R26 R28 R29 RP1 RP2 = RES 1*4
R30 R31 = RES1: Resistor; Value: 100R,0.1%
TP3 TP4 = TP: Connector
U2 = LM339
U3 = Op Amp_1ch: FET Operational Amplifier; Published: 8-Jun-2000; Revision: July-2002: Re-released for DXP Platform.; Datasheet: Latest Revision: REV. B; Package Reference: H-08A; Publisher: Altium Limited
U4 = STM32F103RBT6: STM32 ARM-based 32-bit MCU with 128 Kbytes Flash, 64-pin LQFP, Industrial Temperature; Published: *; DatasheetVersion: *; PackageVersion: *; PackageReference: *; Publisher: *; PackageDescription: *; ComponentLink1Description: *; ComponentLink1URL: *; ComponentLink2Description: *; ComponentLink2URL: *
U8 U10 = ULN2803
U9 U12 U13 U16 U21 = 74HC245
U11 U19 = Op Amp_Instrumentation: 仪表放大器; Published: 8-Jun-2000; Revision: July-2002: Re-released for DXP Platform.; Datasheet: Latest Revision: REV. B; Package Reference: H-08A; Publisher: Altium Limited
U18 = REF3040: 电压参考
VR3 = POT1B: Potentiometer
Y2 = CRYSTAL: Value: 8Mhz

## Nets that join several sheets
A+5V: Power (PTC1.2), tempContr (25 pins)
A-5V: Power (C5.1 FB2.2), tempContr (C14.1 R24.1 U3.4)
PGND: MB_TOP (GND1.1 GND2.1 GND3.1), Power (36 pins), tempContr (120 pins)
VDD3.3B: Power (C85.1 U5.3 U5.4), tempContr (25 pins)
VDD5V: Power (C12.1 C83.1 U1.3 U5.1), tempContr (13 pins)
VDD12: Power (7 pins), tempContr (5 pins)
VM: Power (10 pins), tempContr (59 pins)